# Altium schematic sheet USB.SchDoc: Air724UG 参考设计
size 594 x 419 mm; DESIGNER: Loukanghua; REV: V1.0
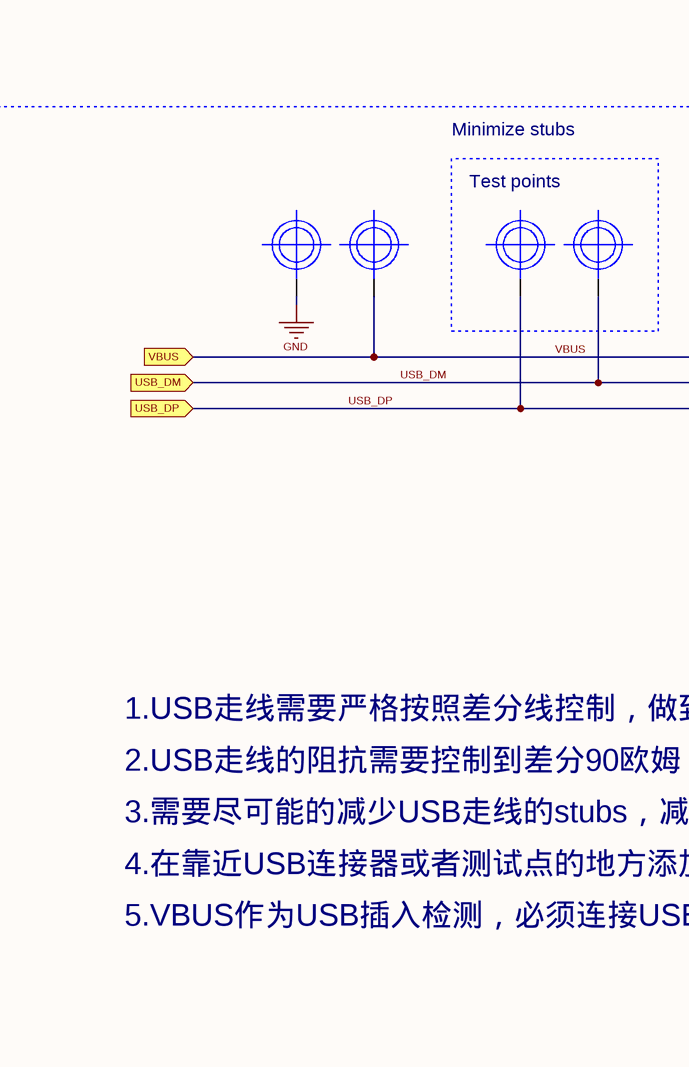
[diagram p0: USB.SchDoc, top left]
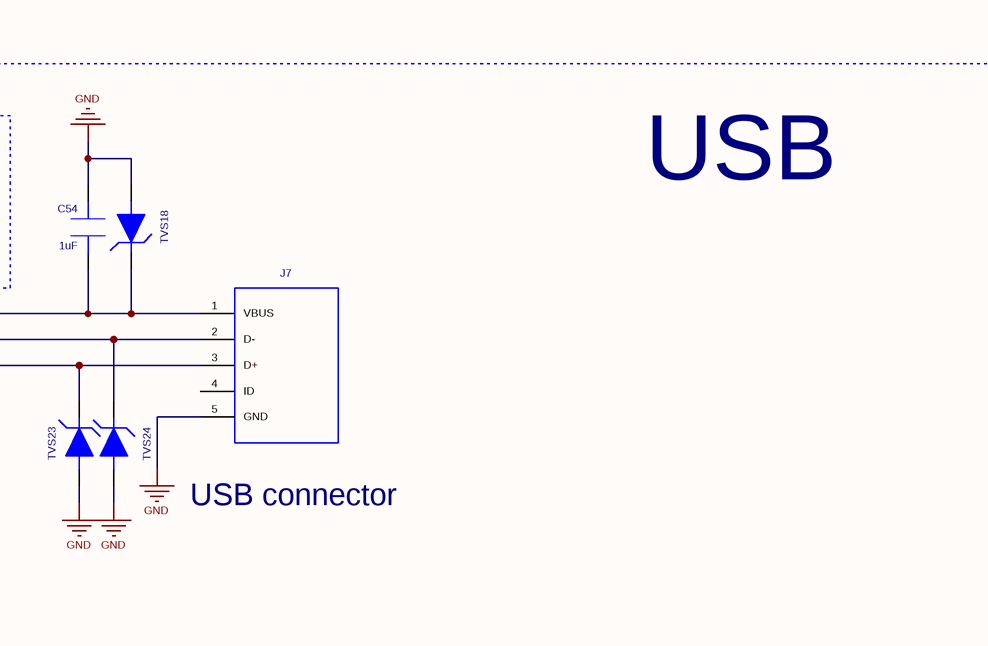
[diagram p1: USB.SchDoc, top middle]
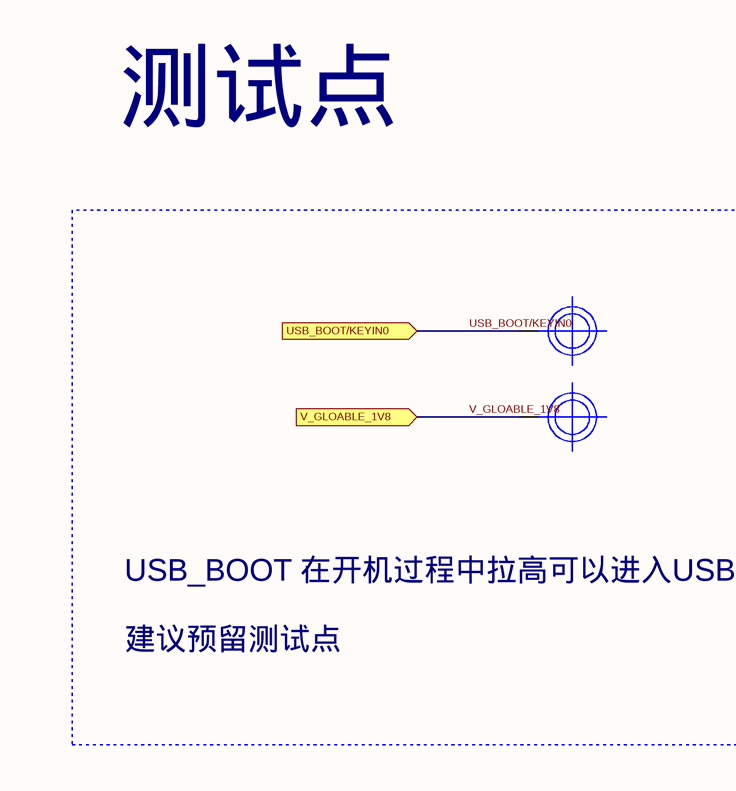
[diagram p2: USB.SchDoc, bottom left]
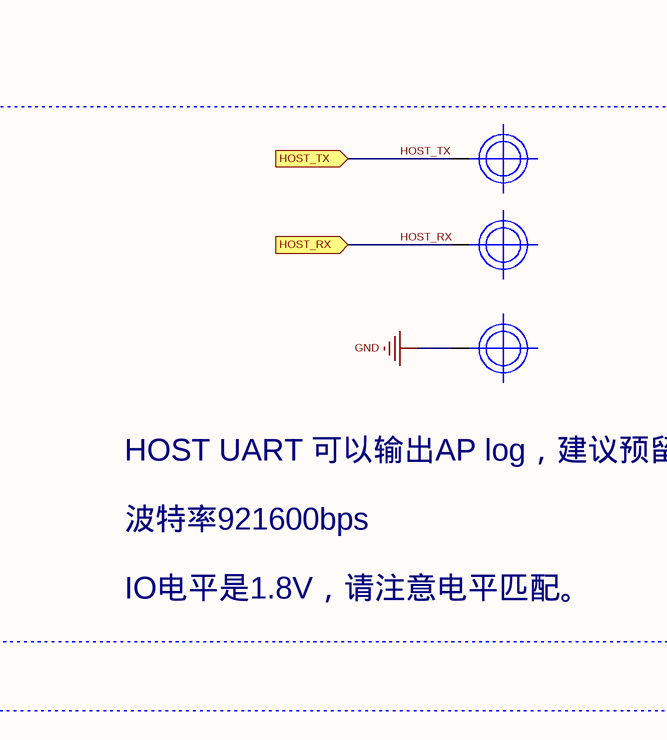
[diagram p3: USB.SchDoc, bottom middle]
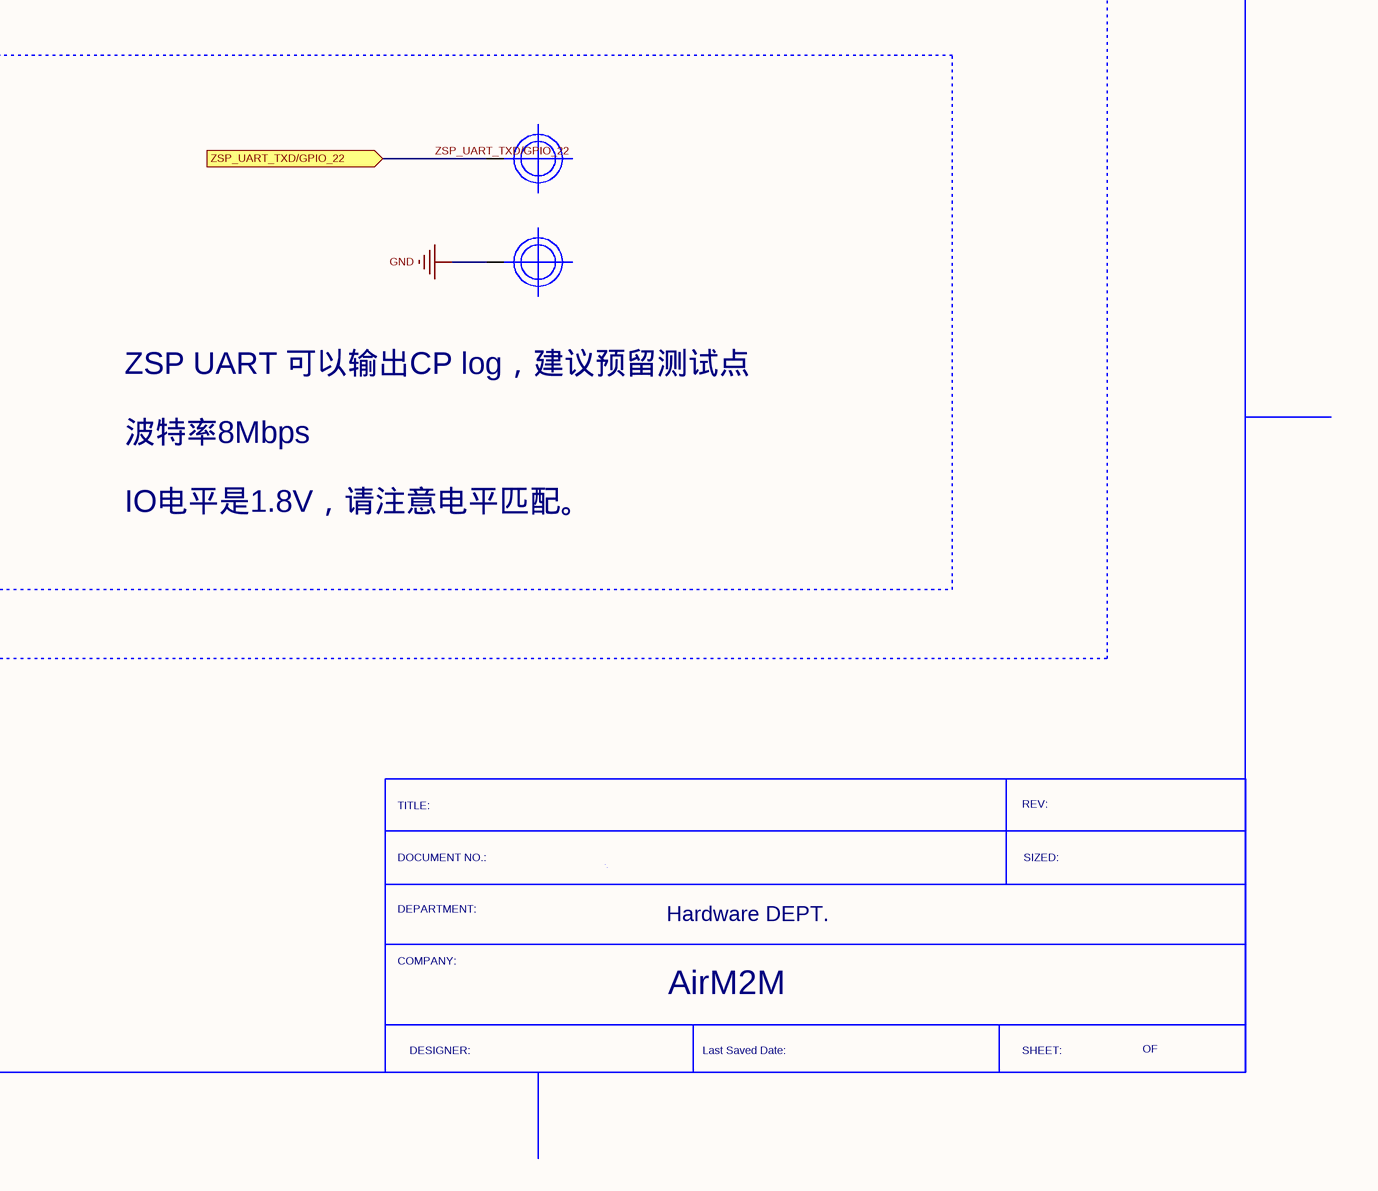
[diagram p4: USB.SchDoc, bottom right]

## Parts
C54  value 1uF  [SC0402]  (hidden comment: CAP-1000PF-0402-X7R)
J7  USB-MICRO-10305060GSAR001  [USB90DEGREE]  (value not drawn)
T1  TESTPOINT  [TP1_5]  (value not drawn)
T2  TESTPOINT  [TP1_5]  (value not drawn)
T3  TESTPOINT  [TP1_5]  (value not drawn)
T4  TESTPOINT  [TP1_5]  (value not drawn)
T5  TESTPOINT  [TP1_5]  (value not drawn)
T6  TESTPOINT  [TP1_5]  (value not drawn)
T7  TESTPOINT  [TP1_5]  (value not drawn)
T8  TESTPOINT  [TP1_5]  (value not drawn)
T9  TESTPOINT  [TP1_5]  (value not drawn)
T10  TESTPOINT  [TP1_5]  (value not drawn)
T11  TESTPOINT  [TP1_5]  (value not drawn)
TVS18  ESD-TVS-ESD9X7.0ST5G  [SOD-923-ESD9X5.0ST5G]  (value not drawn)
TVS23  ESD-TVS-ESD9L5.0T5G  [SOD-923-ESD9L5.0T5G]  (value not drawn)
TVS24  ESD-TVS-ESD9L5.0T5G  [SOD-923-ESD9L5.0T5G]  (value not drawn)

## Blocks framed on the sheet
USB: C54 J7 T1-T4 TVS18 TVS23 TVS24
测试点: T5-T11

## Ports
HOST_RX, HOST_TX, USB_BOOT/KEYIN0, USB_DM, USB_DP, V_GLOABLE_1V8, VBUS, ZSP_UART_TXD/GPIO_22

## Nets
GND: C54.2 J7.5(GND) J7.6(GND) J7.7(GND) T3.1 T9.1 T11.1 TVS18.2 TVS23.2 TVS24.2
HOST_RX: T8.1 ; port HOST_RX
HOST_TX: T7.1 ; port HOST_TX
USB_BOOT/KEYIN0: T5.1 ; port USB_BOOT/KEYIN0
USB_DM: J7.2(D-) T2.1 TVS24.1 ; port USB_DM
USB_DP: J7.3(D+) T1.1 TVS23.1 ; port USB_DP
V_GLOABLE_1V8: T6.1 ; port V_GLOABLE_1V8
VBUS: C54.1 J7.1(VBUS) T4.1 TVS18.1 ; port VBUS
ZSP_UART_TXD/GPIO_22: T10.1 ; port ZSP_UART_TXD/GPIO_22

Not connected (* = marked no-connect by the designer): J7 4(ID)

## Notes on the sheet
- Minimize stubs
- Test points
- USB connector
- 1.USB走线需要严格按照差分线控制，做到平行和等长；
- 2.USB走线的阻抗需要控制到差分90欧姆；
- 3.需要尽可能的减少USB走线的stubs，减少信号反射；USB信号的测试点最好直接放在走线上以减少stub
- 4.在靠近USB连接器或者测试点的地方添加TVS保护管，由于USB的速率较高，需要注意TVS管的选型，保证选用的TVS保护管的寄生电容小于1pF
- 5.VBUS作为USB插入检测，必须连接USB电源或者外接电源，否则USB无法被检测到，VBUS的检测电压要大于3.3V
- HOST UART 可以输出AP log，建议预留测试点
- ZSP UART 可以输出CP log，建议预留测试点
- USB_BOOT 在开机过程中拉高可以进入USB下载模式
- 建议预留测试点
- 波特率921600bps
- 波特率8Mbps
- IO电平是1.8V，请注意电平匹配。
- TITLE:
- REV:
- DEPARTMENT:
- DOCUMENT NO.:
- Hardware DEPT.
- SIZED:
- COMPANY:
- AirM2M
- DESIGNER:
- Last Saved Date:
- SHEET:
- OF

## Library data of the parts
C54 = CAP-1000PF-0402-X7R: CAP CER X7R;1000PF;+/-10%;50V;0402;0.5mm;ROHS; Manufacture 1: MURATA;Yageo;Walsin;Eyang; Manufacture 1 P/N: GRM155R71H102K****;CC0402KRX7R9BB102;0402B102K500CT;C0402X7R102K500N*; Geometry.Height: 0.55mm; Serial Number: 80214750001; Tolerance: +/-10%; PCB DECAL: SC0402
J7 = USB-MICRO-10305060GSAR001: Micro USB 5PIN;插板式;; Manufacture 1: 特图; Geometry.Height: 5.6mm; Manufacture 1 P/N: 10305060GSAR001; PCB DECAL: USB90DEGREE
T1-T11 = TESTPOINT: Geometry.Height: 0.05mm; PCB DECAL: TP1_5
TVS18 = ESD-TVS-ESD9X7.0ST5G: TVS;7.0V;65PF;SOD?923;ROHS; Manufacture 1: ONSEMI; Geometry.Height: 0.43mm; Manufacture 1 P/N: ESD9X7.0ST5G; PCB DECAL: SOD-923-ESD9X5.0ST5G
TVS23 TVS24 = ESD-TVS-ESD9L5.0T5G: TVS;5V;0.5pF;SOD-923;ROHS; Manufacture 1: Onsemi;Will(韦尔)();; Manufacture 1 P/N: ESD9L5.0ST5G;ESD9X5VU-2/TR; Geometry.Height: 0.4mm; Serial Number: 81121000012; PCB DECAL: SOD-923-ESD9L5.0T5G